# EAGLE design schemat_polaczen3 (EAGLE 9.6.2)
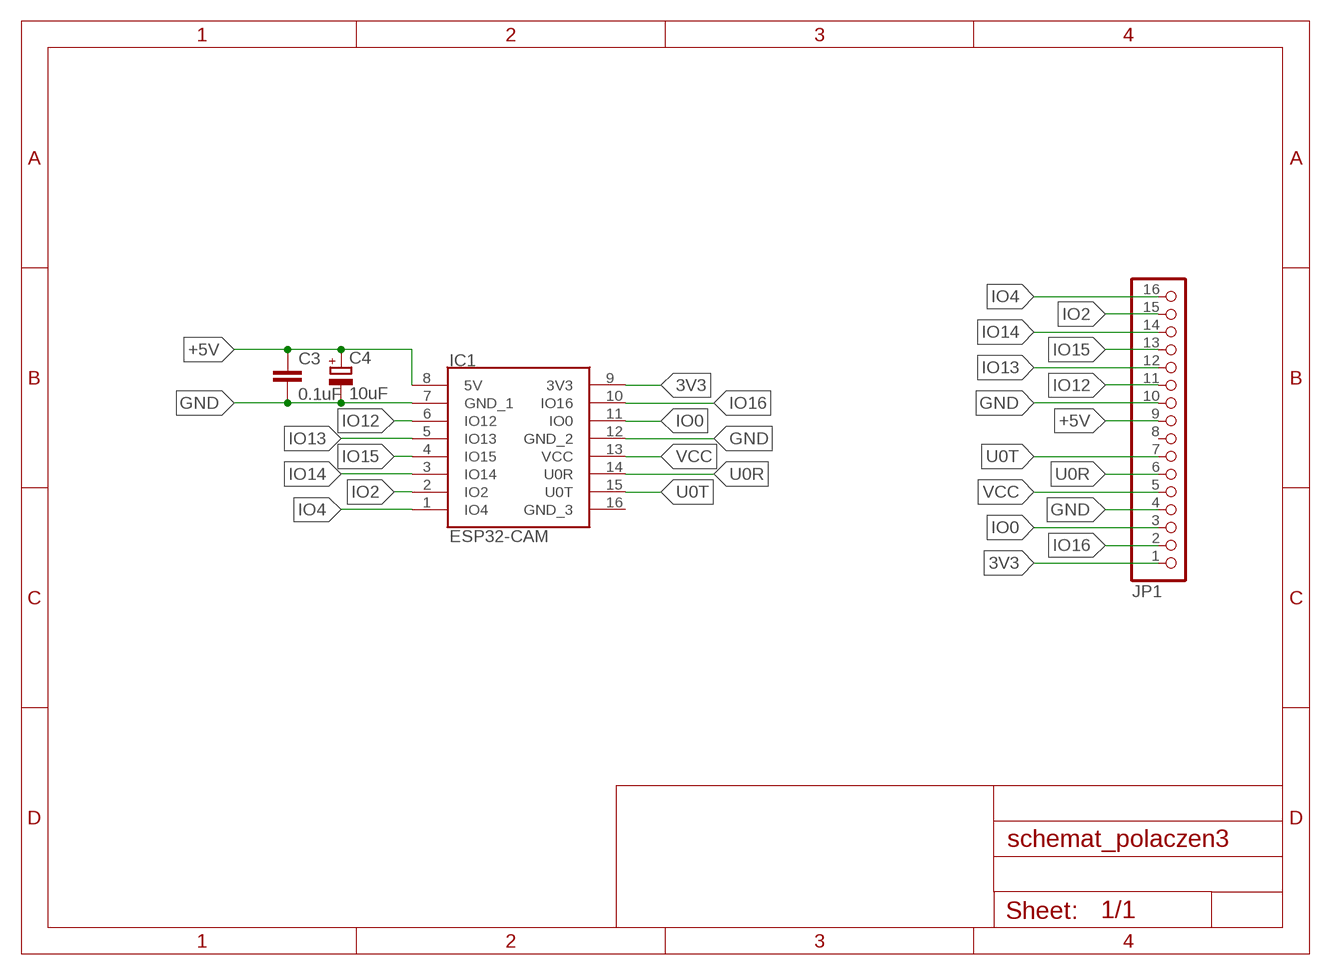
[diagram p0: schematic, sheet 1]

## Parts
C3  0.1uF  C-EU025-024X044  [C025-024X044]
C4  10uF  CPOL-EUE2,5-6E  [E2,5-6E]
IC1  ESP32-CAM  [ESP32CAM]
JP1  PINHD-1X16/90  [1X16/90]

## Nets
3V3: IC1.9(3V3) JP1.1
+5V: C3.1 C4.+ IC1.8(5V) JP1.9
GND: C3.2 C4.- IC1.7(GND_1) IC1.12(GND_2) JP1.4 JP1.10
IO0: IC1.11(IO0) JP1.3
IO2: IC1.2(IO2) JP1.15
IO4: IC1.1(IO4) JP1.16
IO12: IC1.6(IO12) JP1.11
IO13: IC1.5(IO13) JP1.12
IO14: IC1.3(IO14) JP1.14
IO15: IC1.4(IO15) JP1.13
IO16: IC1.10(IO16) JP1.2
U0R: IC1.14(U0R) JP1.6
U0T: IC1.15(U0T) JP1.7
VCC: IC1.13(VCC) JP1.5
Unconnected: IC1.16(GND_3) JP1.8

## Library data of the parts
C3 = rcl:C-EU: CAPACITOR, European symbol; SPICEPREFIX: C
C4 = rcl:CPOL-EU: POLARIZED CAPACITOR, European symbol; SPICEPREFIX: C
IC1 = ESP32-CAM:ESP32-CAM: Modules PCBA Module RoHS Source: Datasheet <https://datasheet.lcsc.com/szlcsc/Ai-Thinker-ESP32-CAM_C277946.pdf>; DESCRIPTION: Modules PCBA Module RoHS; HEIGHT: 5mm; MANUFACTURER_NAME: Ai-Thinker; MANUFACTURER_PART_NUMBER: ESP32-CAM
JP1 = pinhead:PINHD-1X16: PIN HEADER

## Board
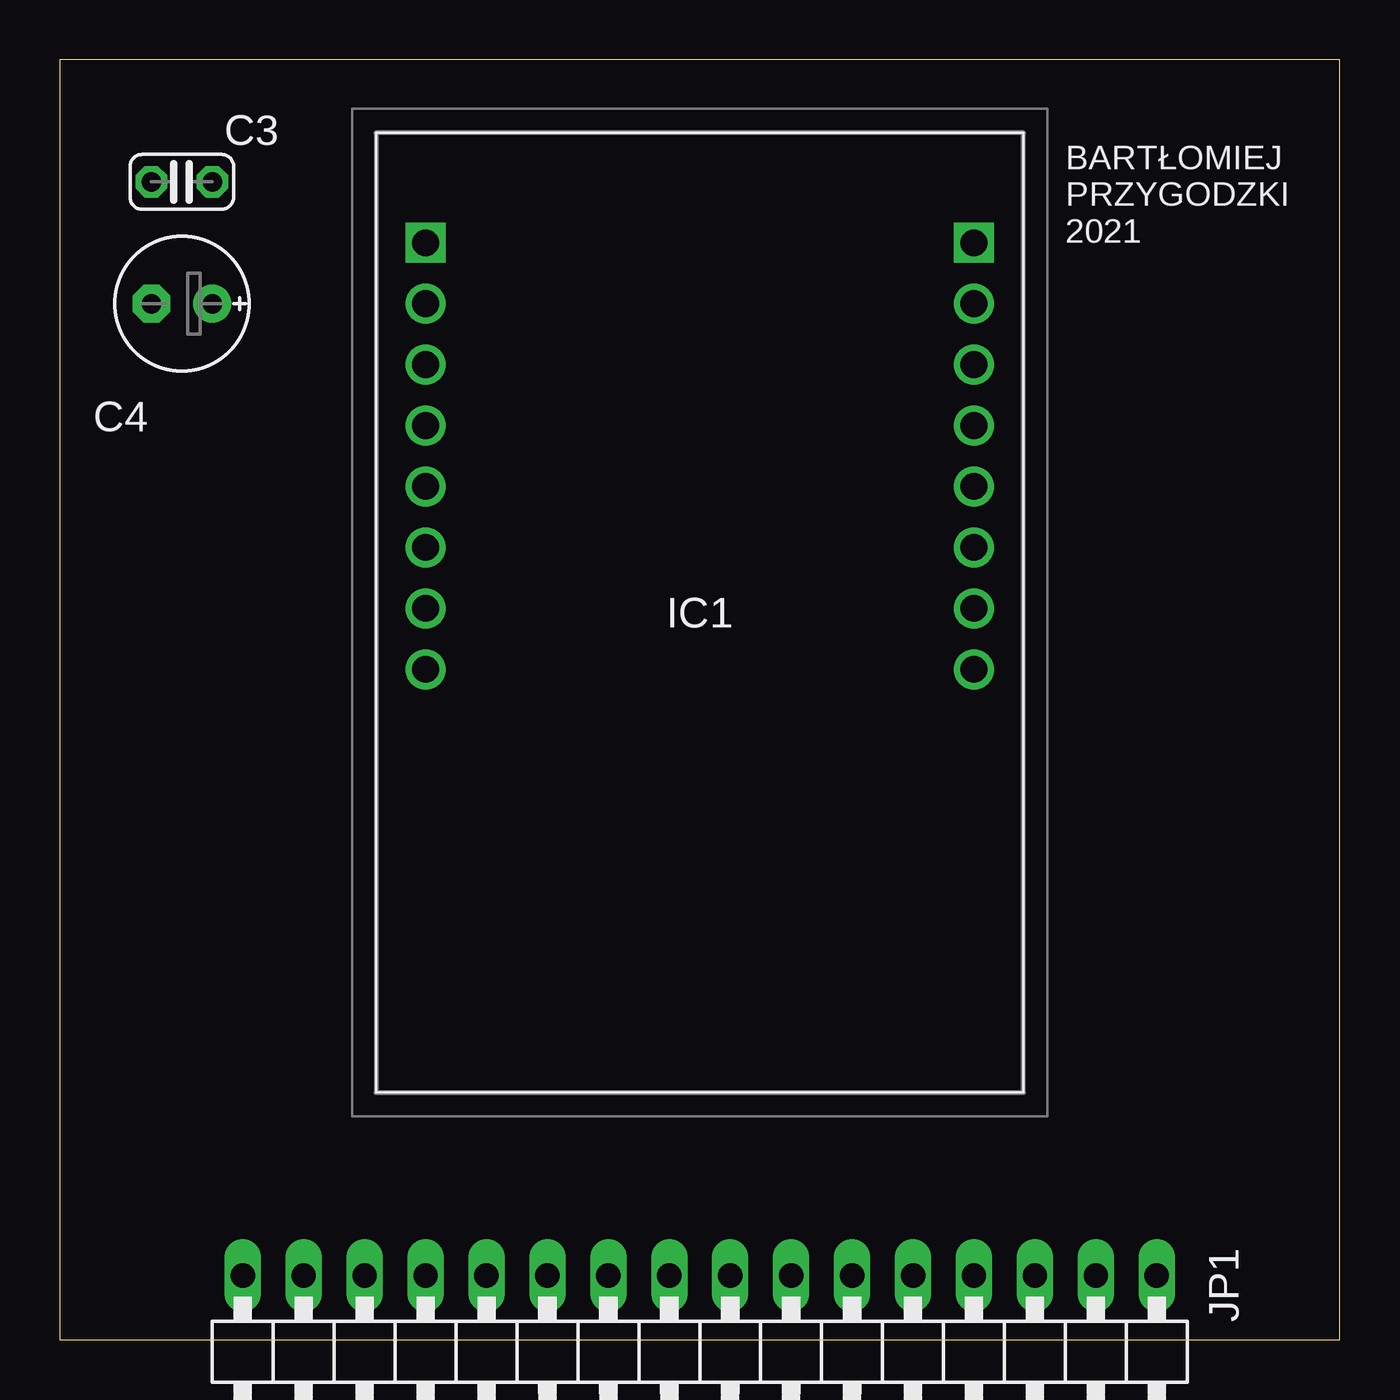
[diagram p1: board, top side]
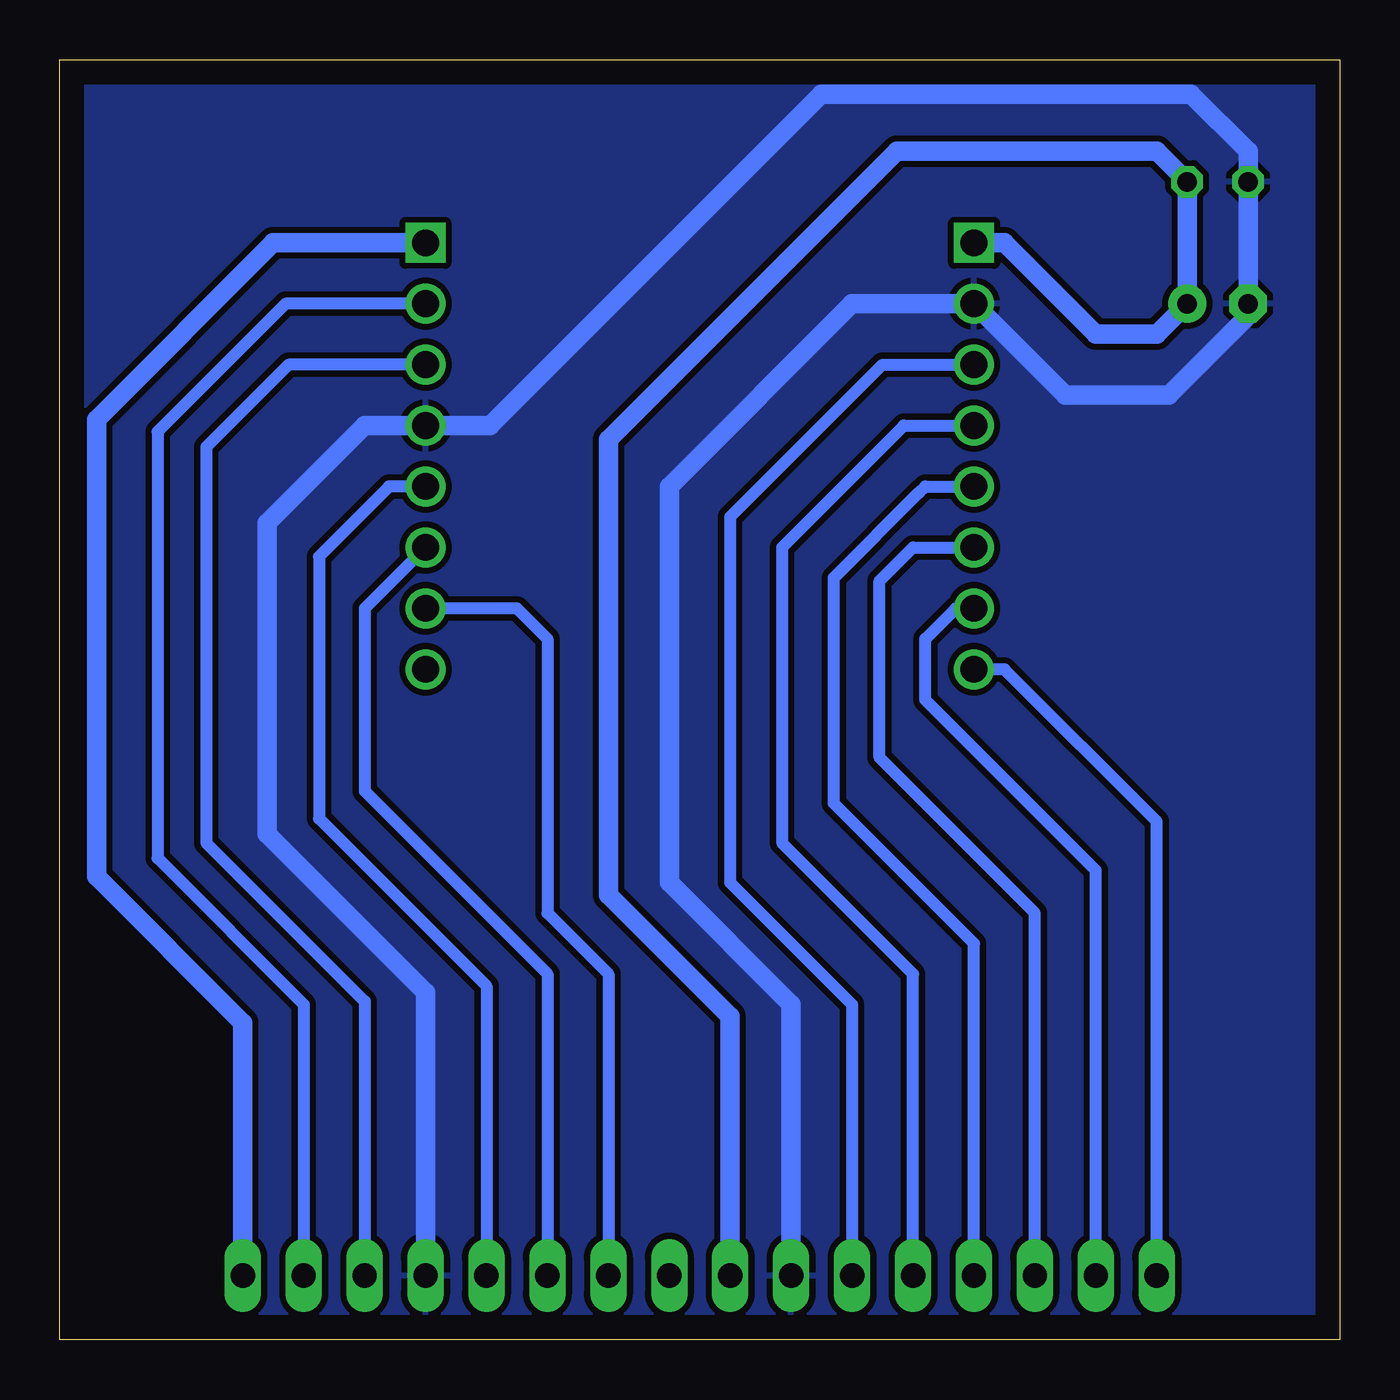
[diagram p2: board, bottom side, seen from below]

Size 53.34 x 53.34 mm. Coordinates in mm from the lower left corner, seen from the top.
Outline: 0,0 53.34,0 53.34,53.34 0,53.34 0,0
Copper layers (1*16): Top 0.035mm / dielectric 1.6mm / Bottom 0.035mm
Design rules "default *": minimum track width 10mil, minimum drill 0.35mm, track to track 10mil, track to pad 20mil, pad to pad 10mil, via to via 10mil, smd to smd 6mil, copper to edge 40mil, drill to drill 40mil, minimum pad ring 10mil, minimum via ring 8mil, stop-mask expansion 4mil, vias tented up to drill 0mil, thermal gap 10mil

### Footprints (pad centres in the part's own frame; a part is rotated, then mirrored left to right if it is on the bottom)
C025-024X044 = drill 0.813 octagon: 1 -1.27,0; 2 1.27,0
E2,5-6E = drill 0.813 pad 1.575: + -1.27,0 | drill 0.813 pad 1.575 octagon: - 1.27,0
ESP32CAM = drill 1.11 pad 1.665: 1 0,0; 2 0,2.54; 3 0,5.08; 4 0,7.62; 5 0,10.16; 6 0,12.7; 7 0,15.24; 10 22.86,15.24; 11 22.86,12.7; 12 22.86,10.16; 13 22.86,7.62; 14 22.86,5.08; 15 22.86,2.54; 16 22.86,0 | drill 1.11 pad 1.665 square: 8 0,17.78; 9 22.86,17.78
1X16/90 = drill 1.016 long: 1 -19.05,-3.81; 2 -16.51,-3.81; 3 -13.97,-3.81; 4 -11.43,-3.81; 5 -8.89,-3.81; 6 -6.35,-3.81; 7 -3.81,-3.81; 8 -1.27,-3.81; 9 1.27,-3.81; 10 3.81,-3.81; 11 6.35,-3.81; 12 8.89,-3.81; 13 11.43,-3.81; 14 13.97,-3.81; 15 16.51,-3.81; 16 19.05,-3.81

### Placement (x,y rotation side)
C3  5.08,48.26 180 top
C4  5.08,43.18 180 top
IC1  15.24,27.94 0 top
JP1  26.67,-1.14 180 top

### Tracks (layer width: path | path; a pad name or v marks a point on that pad's centre or on a via)
3V3
  Bottom 0.813: IC1.9 44.45,45.72 51.82,38.35 51.82,19.3 45.72,13.21 JP1.1
+5V
  Bottom 0.813: IC1.8 13.97,45.72 10.16,41.91 7.62,41.91 C4.+ C3.1 7.62,49.53 18.46,49.53 30.48,37.51 30.48,18.54 25.4,13.46 JP1.9
GND
  Bottom 0.813: JP1.4 38.1,14.48 44.7,21.08 44.7,34.04 40.64,38.1 IC1.12 35.41,38.1 21.59,51.92 6.2,51.92 3.81,49.53 C3.2 C4.- 3.81,42.67 7.11,39.37 11.43,39.37 IC1.7 20.32,43.18 27.94,35.56 27.94,19.05 22.86,13.97 JP1.10
  pour Bottom: 0,53.34 53.34,53.34 53.34,0 0,0
IO0
  Bottom 0.508: IC1.11 43.81,40.64 47.24,37.21 47.24,20.7 40.64,14.1 JP1.3
IO2
  Bottom 0.508: JP1.15 10.16,19.56 17.27,26.67 17.27,29.21 16,30.48 IC1.2
IO4
  Bottom 0.508: JP1.16 7.62,21.59 13.97,27.94 IC1.1
IO12
  Bottom 0.508: JP1.11 20.32,13.97 25.4,19.05 25.4,34.29 19.05,40.64 IC1.6
IO13
  Bottom 0.508: JP1.12 17.78,15.24 23.24,20.7 23.24,33.02 18.16,38.1 IC1.5
IO14
  Bottom 0.508: JP1.14 12.7,17.78 19.18,24.26 19.18,31.62 17.78,33.02 IC1.3
IO15
  Bottom 0.508: JP1.13 15.24,16.51 21.08,22.35 21.08,31.75 17.53,35.31 17.27,35.56 IC1.4
IO16
  Bottom 0.508: IC1.10 43.94,43.18 49.28,37.85 49.28,20.07 43.18,13.97 JP1.2
U0R
  Bottom 0.508: IC1.14 40.64,30.48 40.64,22.86 33.02,15.24 JP1.6
U0T
  Bottom 0.508: JP1.7 30.48,15.24 33.02,17.78 33.02,29.21 34.29,30.48 IC1.15
VCC
  Bottom 0.508: IC1.13 39.62,35.56 42.55,32.64 42.55,21.72 35.56,14.73 JP1.5

### Text on the board
tNames: BARTŁOMIEJ / PRZYGODZKI / 2021